# Altium schematic sheet Power.SchDoc
size A4; SheetNumber: 1; SheetTotal: 4
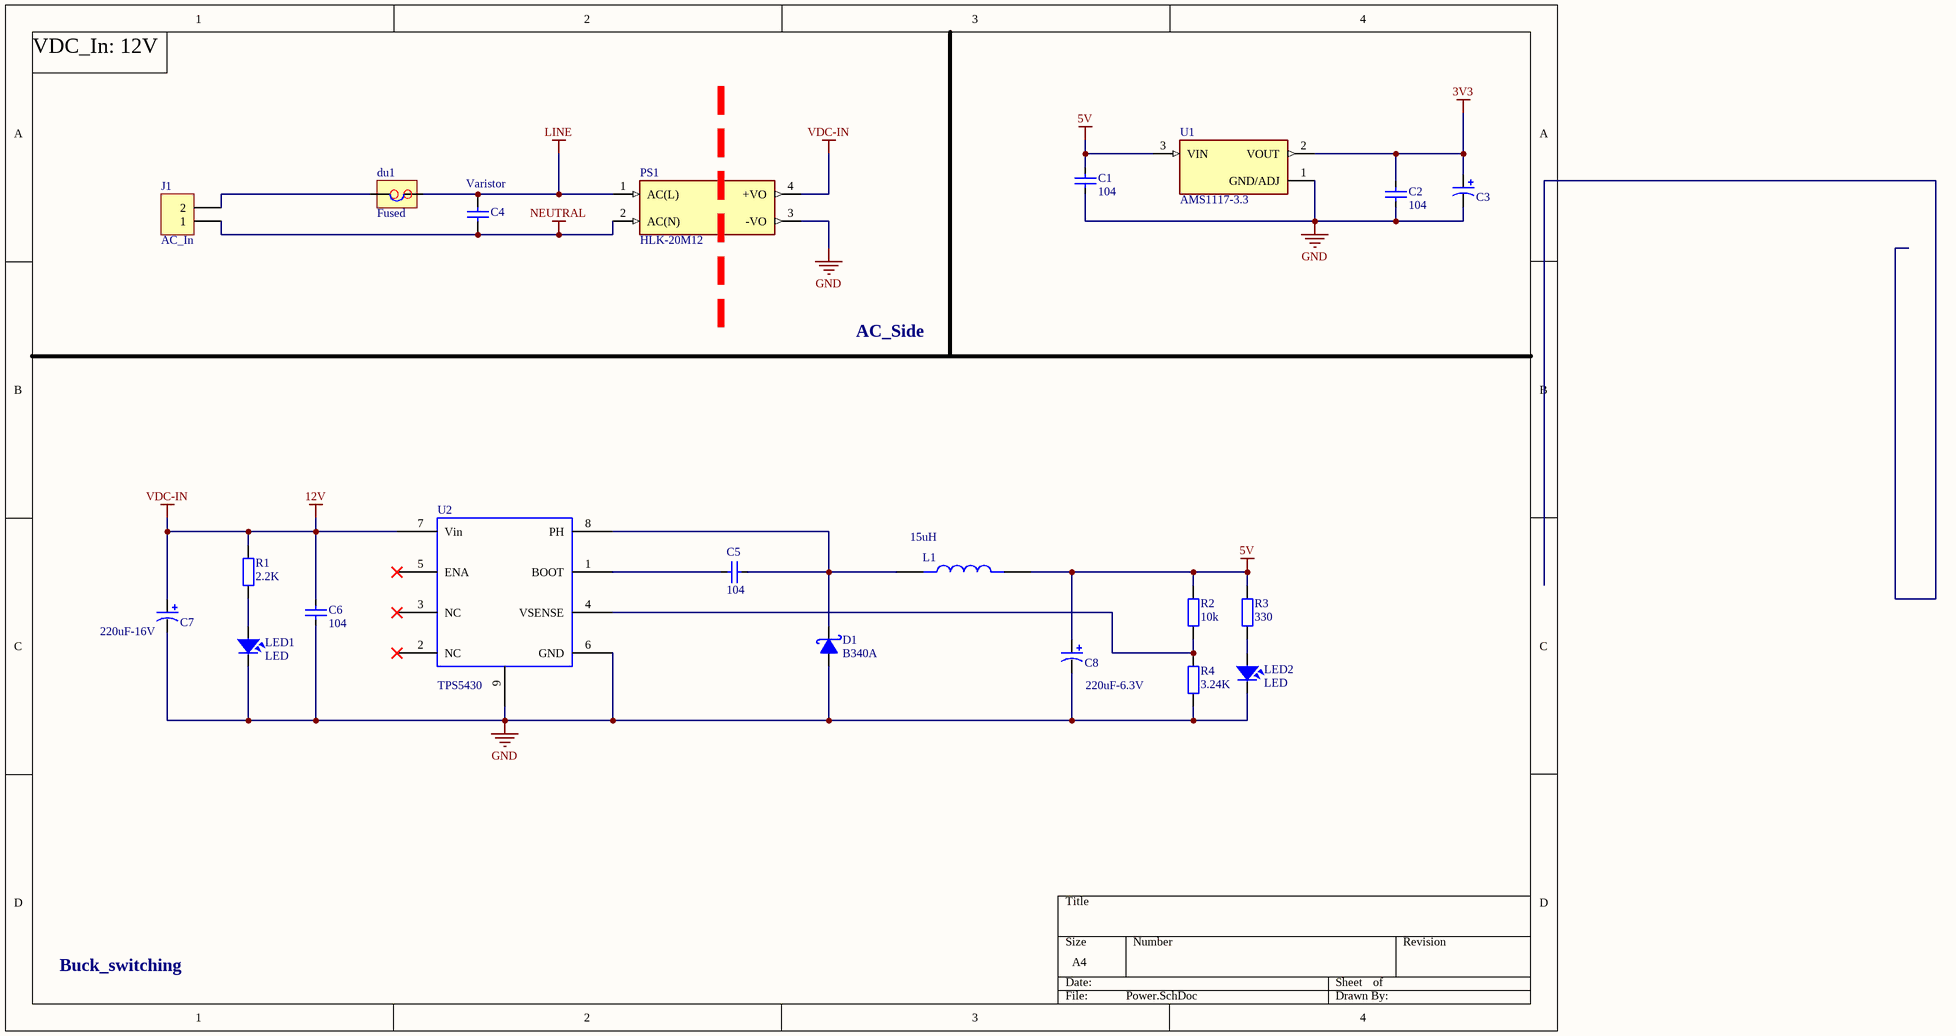
[diagram p0: Power.SchDoc]

## Parts
C1  104  [CAP_0805]
C2  104  [CAP_0805]
C3  100uF  [CAP_7343]  (value not drawn)
C4  Varistor  [CAP_MICA_6MM]
C5  104  [CAP_0805]
C6  104  [CAP_0805]
C7  220uF-16V  [CAP_7343]
C8  220uF-6.3V  [CAP_7343]
D1  B340A  [SMA]
du1  Fused  [FUSRR1015W52L1650T300H2620]
J1  AC_In  [KF2-5.08T]
L1  15uH  [IND_ASPI-0630LR-150M-T15]
LED1  LED  [LED-0805-Blue]
LED2  LED  [LED-0805-Blue]
PS1  HLK-20M12  [CONV_HLK-20M12]
R1  2.2K  [RES-SMD-0805]
R2  10k  [RES-SMD-0805]
R3  330  [RES-SMD-0805]
R4  3.24K  [RES-SMD-0805]
U1  AMS1117-3.3  [SOT229P700X180-4N]
U2  TPS5430  [TPS5430-2]

## Nets
3V3: C2.1 C3.1 U1.2(VOUT)
5V: C1.1 C8.1 L1.2 R2.2 R3.2 U1.3(VIN)
12V: C6.1 C7.1 PS1.4(+VO) R1.2 U2.7(Vin)  [also labelled VDC-IN]
GND: C1.2 C2.2 C3.2 C6.2 C7.2 C8.2 D1.1(A) LED1.2 LED2.2 PS1.3(-VO) R4.1 U1.1(GND/ADJ) U2.6(GND) U2.9(PWR_PAD)
LINE: C4.1 du1.2 PS1.1(AC(L))
NEUTRAL: C4.2 J1.1 PS1.2(AC(N))
NetC5_1: C5.1 U2.1(BOOT)
NetC5_2: C5.2 D1.2(K) L1.1 U2.8(PH)
Netdu1_1: du1.1 J1.2
NetLED1_1: LED1.1 R1.1
NetLED2_1: LED2.1 R3.1
NetR2_1: R2.1 R4.2 U2.4(VSENSE)

Not connected (* = marked no-connect by the designer): U2 2(NC)* 3(NC)* 5(ENA)*

## Notes on the sheet
- VDC_In: 12V
- AC_Side
- Buck_switching

## Library data of the parts
C1 C2 = CapSMD: Capacitor; Value: 33p; Published: 8-Jun-2000; LatestRevisionDate: 17-Jul-2002; LatestRevisionNote: Re-released for DXP Platform.; PackageReference: RAD-0.3; Publisher: Altium Limited
C3 = CAP_TAN_SMD: https://linhkien.cxt.vn/8805-tu-tantalum-100uf-63v-7343-73x43mm.html
C4 = CapCeramic: 10D561K; Value: 33p; Published: 8-Jun-2000; LatestRevisionDate: 17-Jul-2002; LatestRevisionNote: Re-released for DXP Platform.; PackageReference: RAD-0.3; Publisher: Altium Limited
C5 C6 = CapSMD: https://linhkien.cxt.vn/9232-tu-104-01uf-100nf-0805-25v-10-10c.html; Value: 33p; Published: 8-Jun-2000; LatestRevisionDate: 17-Jul-2002; LatestRevisionNote: Re-released for DXP Platform.; PackageReference: RAD-0.3; Publisher: Altium Limited
C7 C8 = CAP_TAN_SMD: https://linhkien.cxt.vn/2032-tu-tantalum-7343-cac-gia-tri.html
D1 = Diode Schottky: https://linhkien.cxt.vn/4563-b340a-13-f-diode-schottky-3a-40v-smado-214ac.html
du1 = FuseNote2
J1 = KF2: Manufacturer: Würth Elektronik eiSos GmbH; partNo: 691103110002; ComponentLink1 Description: Manufacturer; ComponentLink2 Description: Datasheet; NoPins: 2; Created Date: 29 October 2013; ComponentLink1URL: http://www.we-online.com; ComponentLink2URL: http://katalog.we-online.de/em/datasheet/6911031100xx.pdf; Created by: Karrer Zheng
L1 = ASPI-0630LR-150M-T15: https://linhkien.cxt.vn/3445-cuon-cam-150-15uh-0630-3a-7x7x3mm.html; MF: Abracon LLC; Check_prices: https://www.snapeda.com/parts/ASPI-0630LR-150M-T15/Abracon+LLC/view-part/?ref=eda; Digi-Key_Part_Number: ASPI-0630LR-150M-T15TR-ND; Value: *; SnapEDA_Link: https://www.snapeda.com/parts/ASPI-0630LR-150M-T15/Abracon+LLC/view-part/?ref=snap; Package: Nonstandard Abracon LLC; MP: ASPI-0630LR-150M-T15; Purchase-URL: https://pricing.snapeda.com/search/part/ASPI-0630LR-150M-T15/?ref=eda
LED1 LED2 = LED: LED Single colour Green and Red; Value: LED 3 ly Single Colour
PS1 = HLK-20M12: 20W ultra-small series module power supply; MF: Hi-link; Check_prices: https://www.snapeda.com/parts/HLK-20M12/Hi-link/view-part/?ref=eda; SnapEDA_Link: https://www.snapeda.com/parts/HLK-20M12/Hi-link/view-part/?ref=snap; Availability: Not in stock; Price: None; Value: *; MP: HLK-20M12; Package: Non-Standard Hi-link
R1 = Resistor - SMD: https://linhkien.cxt.vn/5089-dien-tro-0805-1-thong-so-tu-1k-den-91k.html; Manufacturer: Generic Components; Class: Passive; Published: 08/06/2000; Publisher: Altium Hobart Technology Centre
R2 = Resistor - SMD: https://linhkien.cxt.vn/6741-dien-tro-0805-1-thong-so-tu-1k-den-91k.html; Manufacturer: Generic Components; Class: Passive; Published: 08/06/2000; Publisher: Altium Hobart Technology Centre
R3 = Resistor - SMD: https://linhkien.cxt.vn/2346-dien-tro-0805-1-thong-so-tu-1k-den-91k.html; Manufacturer: Generic Components; Class: Passive; Published: 08/06/2000; Publisher: Altium Hobart Technology Centre
R4 = Resistor - SMD: https://linhkien.cxt.vn/6162-dien-tro-59k-0805-1-50c.html; Manufacturer: Generic Components; Class: Passive; Published: 08/06/2000; Publisher: Altium Hobart Technology Centre
U1 = AMS1117-3.3: Sot223/Pkg 1-Amp 3.3-Volt Low Drop Out Voltage Regulatator; MF: Advanced Monolithic Systems; Package: SOT-223 Seeed Technology; Value: *; Check_prices: https://www.snapeda.com/parts/AMS1117-3.3/Advanced+Monolithic+Systems/view-part/?ref=eda; Price: None; Availability: Not in stock; MP: AMS1117-3.3; SnapEDA_Link: https://www.snapeda.com/parts/AMS1117-3.3/Advanced+Monolithic+Systems/view-part/?ref=snap
U2 = TPS5430: https://linhkien.cxt.vn/7312-tps54302ddct-ic-reg-buck-adj-3a-tsot23-6.html; Name: TPS5430